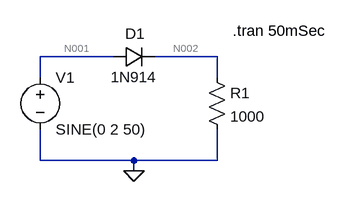
[diagram p0: schematic 7.asc]
7.asc, the LTspice schematic file:
Version 4
SHEET 1 880 680
WIRE 160 32 48 32
WIRE 320 32 224 32
WIRE 48 64 48 32
WIRE 320 64 320 32
WIRE 48 192 48 144
WIRE 192 192 48 192
WIRE 320 192 320 144
WIRE 320 192 192 192
WIRE 192 208 192 192
FLAG 192 208 0
SYMBOL voltage 48 48 R0
WINDOW 123 0 0 Left 0
WINDOW 39 0 0 Left 0
SYMATTR InstName V1
SYMATTR Value SINE(0 2 50)
SYMBOL diode 160 48 R270
WINDOW 0 36 34 VTop 2
WINDOW 3 0 32 VBottom 2
SYMATTR InstName D1
SYMATTR Value 1N914
SYMBOL res 304 48 R0
SYMATTR InstName R1
SYMATTR Value 1000
TEXT 344 -8 Left 2 !.tran 50mSec

The netlist it stands for:
* 7.asc
V1 N001 0 SINE(0 2 50)
D1 N001 N002 1N914
R1 N002 0 1000
.model D D
.lib standard.dio
.tran 50mSec
.backanno
.end

* Results of the author's LTspice run, read from the files saved beside the schematic
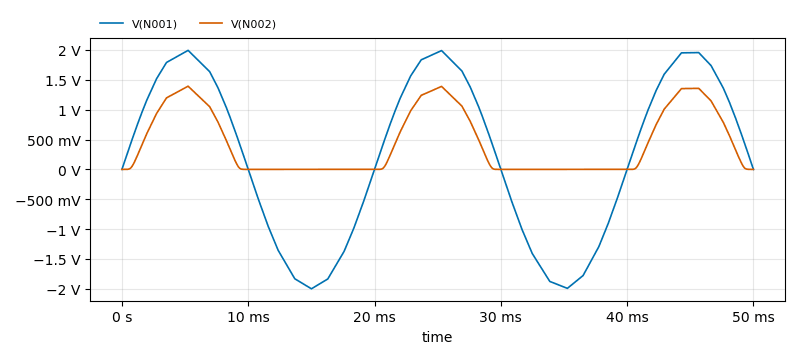
[diagram p1: Transient Analysis of 7.asc, plotted from the saved traces]
* Transient Analysis, 1 run:
*   V(N001): min -2 V, max 1.993 V, average 251.7 mV, rms 1.401 V, last 0 V
*   V(N002): min -4.937 µV, max 1.393 V, average 444.5 mV, rms 693.7 mV, last -2.501 µV